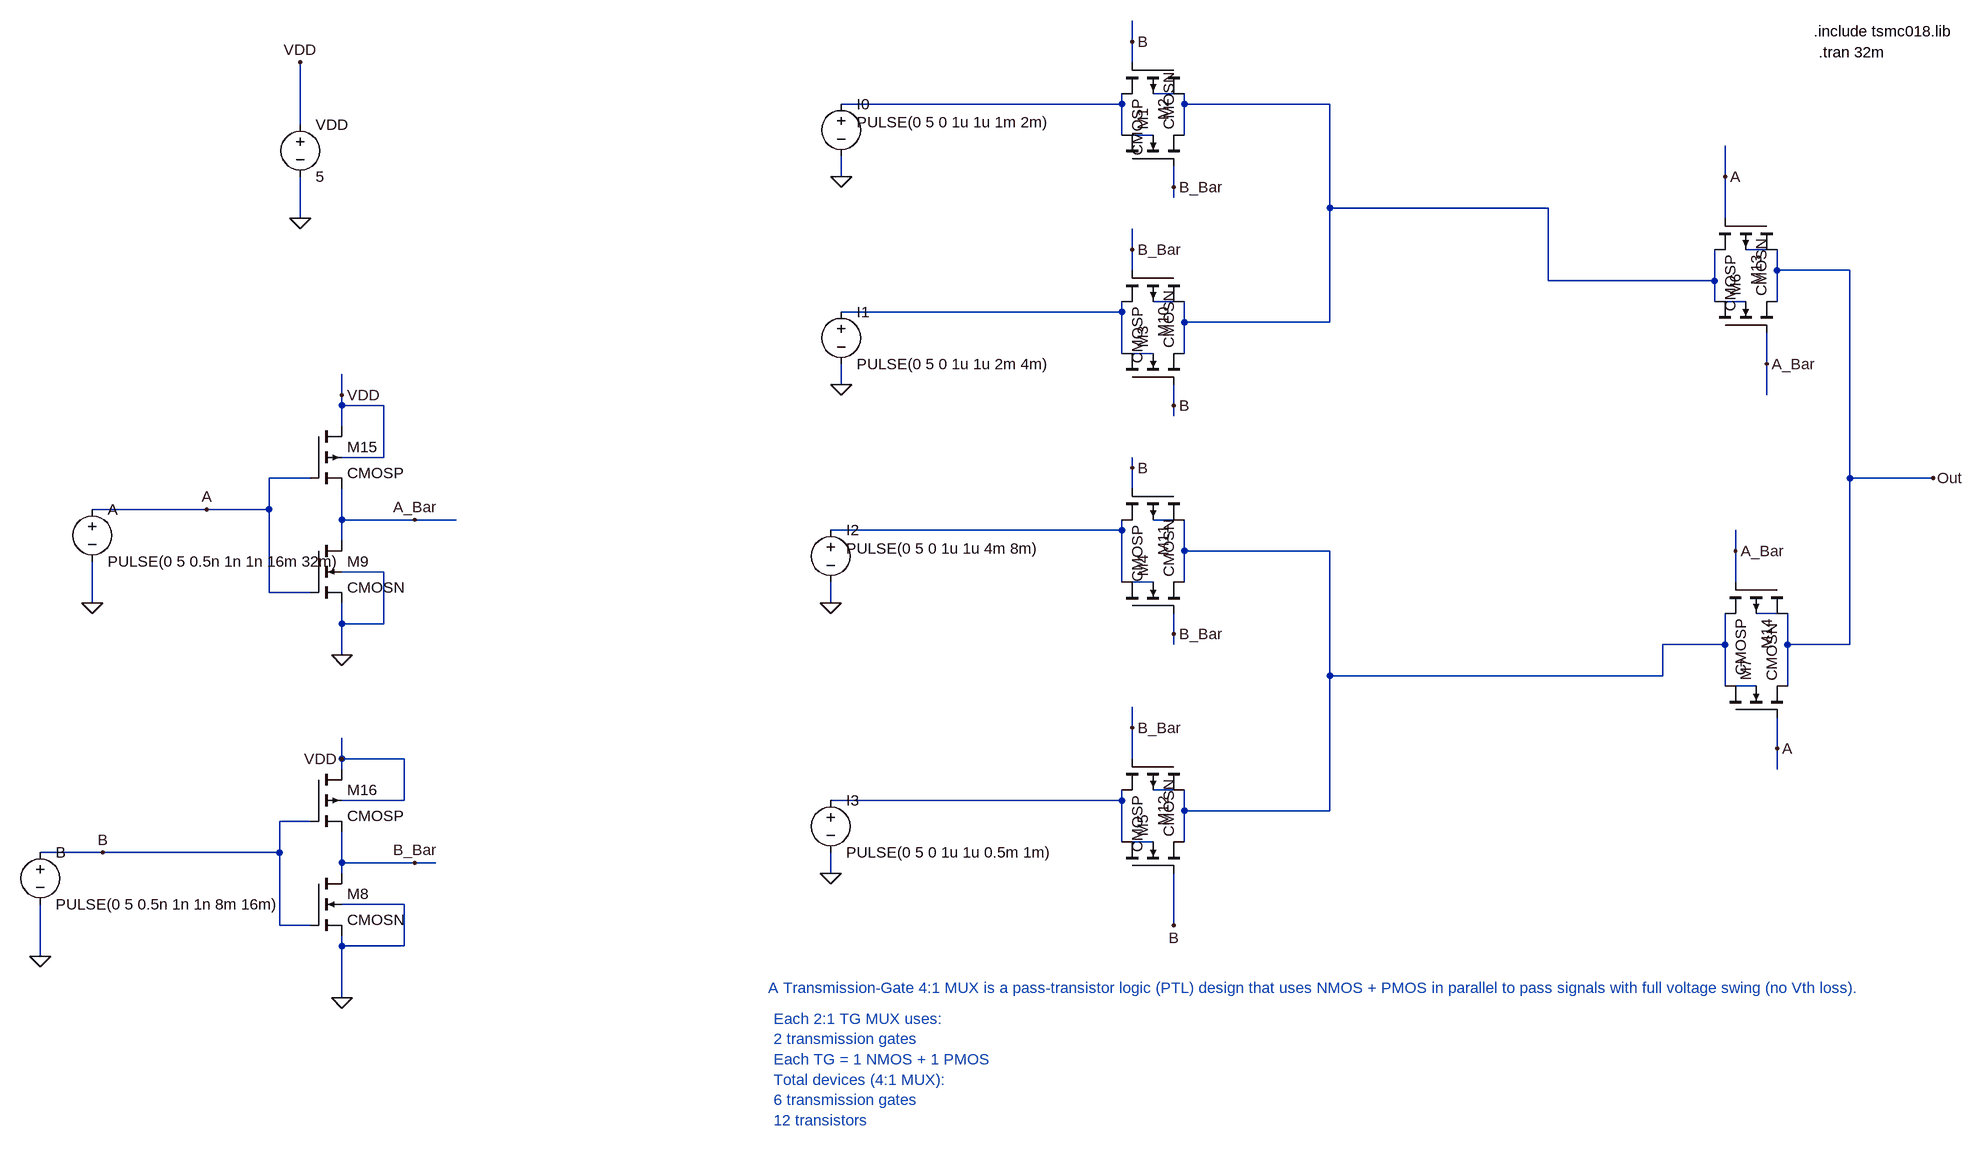
[diagram p0: schematic 4_1_Mux.asc]
4_1_Mux.asc, the LTspice schematic file:
Version 4
SHEET 1 1484 1848
WIRE 192 -160 192 -192
WIRE 192 -128 192 -160
WIRE 256 -80 224 -80
WIRE 176 -64 176 -80
WIRE 176 -64 -256 -64
WIRE 272 -64 272 -80
WIRE 496 -64 272 -64
WIRE -1088 -32 -1088 -128
WIRE 176 -16 176 -64
WIRE 224 -16 192 -16
WIRE 272 -16 272 -64
WIRE -256 48 -256 16
WIRE 1104 48 1104 0
WIRE 256 64 256 32
WIRE 256 80 256 64
WIRE 496 96 496 -64
WIRE 832 96 496 96
WIRE -1088 112 -1088 48
WIRE 1104 112 1104 48
WIRE 192 160 192 128
WIRE 1168 160 1136 160
WIRE 192 192 192 160
WIRE 1184 192 1184 160
WIRE 1296 192 1184 192
WIRE 832 208 832 96
WIRE 1088 208 1088 160
WIRE 1088 208 832 208
WIRE 256 240 224 240
WIRE 1088 240 1088 208
WIRE 1136 240 1104 240
WIRE 1184 240 1184 192
WIRE 176 256 176 240
WIRE 176 256 -256 256
WIRE 272 272 272 240
WIRE 496 272 496 96
WIRE 496 272 272 272
WIRE 176 320 176 256
WIRE 224 320 192 320
WIRE 272 320 272 272
WIRE 1168 336 1168 288
WIRE -256 368 -256 336
WIRE -1024 384 -1024 352
WIRE 1168 384 1168 336
WIRE -1024 400 -1024 384
WIRE -960 400 -1024 400
WIRE 256 400 256 368
WIRE 256 416 256 400
WIRE -1024 432 -1024 400
WIRE -960 480 -960 400
WIRE -960 480 -1024 480
WIRE 192 496 192 480
WIRE -1072 512 -1136 512
WIRE 1296 512 1296 192
WIRE 1424 512 1296 512
WIRE 192 528 192 496
WIRE -1232 560 -1408 560
WIRE -1136 560 -1136 512
WIRE -1136 560 -1232 560
WIRE -1024 576 -1024 528
WIRE -912 576 -1024 576
WIRE -848 576 -912 576
WIRE 256 576 224 576
WIRE 176 592 176 576
WIRE 176 592 -272 592
WIRE -1024 608 -1024 576
WIRE 272 624 272 576
WIRE 496 624 272 624
WIRE 1120 624 1120 592
WIRE -960 656 -1024 656
WIRE 176 672 176 592
WIRE 224 672 192 672
WIRE 272 672 272 624
WIRE 1120 672 1120 624
WIRE -1136 688 -1136 560
WIRE -1072 688 -1136 688
WIRE -1408 704 -1408 640
WIRE -272 704 -272 672
WIRE 1184 720 1152 720
WIRE -1024 736 -1024 704
WIRE -960 736 -960 656
WIRE -960 736 -1024 736
WIRE 256 752 256 720
WIRE 256 768 256 752
WIRE 1104 768 1104 720
WIRE 1104 768 1008 768
WIRE 1200 768 1200 720
WIRE 1296 768 1296 512
WIRE 1296 768 1200 768
WIRE -1024 784 -1024 736
WIRE 496 816 496 624
WIRE 1008 816 1008 768
WIRE 1008 816 496 816
WIRE 1104 832 1104 768
WIRE 1152 832 1120 832
WIRE 1200 832 1200 768
WIRE 192 896 192 864
WIRE 1184 928 1184 880
WIRE -1024 944 -1024 912
WIRE -928 944 -1024 944
WIRE 192 944 192 896
WIRE -1024 960 -1024 944
WIRE 1184 960 1184 928
WIRE 256 992 224 992
WIRE -928 1008 -928 944
WIRE -928 1008 -1024 1008
WIRE 176 1008 176 992
WIRE 176 1008 -272 1008
WIRE 272 1024 272 992
WIRE 496 1024 496 816
WIRE 496 1024 272 1024
WIRE -1072 1040 -1120 1040
WIRE 176 1072 176 1008
WIRE 224 1072 192 1072
WIRE 272 1072 272 1024
WIRE -1392 1088 -1488 1088
WIRE -1120 1088 -1120 1040
WIRE -1120 1088 -1392 1088
WIRE -1024 1104 -1024 1056
WIRE -912 1104 -1024 1104
WIRE -880 1104 -912 1104
WIRE -1024 1120 -1024 1104
WIRE -272 1120 -272 1088
WIRE -928 1168 -1024 1168
WIRE -1120 1200 -1120 1088
WIRE -1072 1200 -1120 1200
WIRE 256 1200 256 1120
WIRE -1024 1232 -1024 1216
WIRE -928 1232 -928 1168
WIRE -928 1232 -1024 1232
WIRE -1488 1248 -1488 1168
WIRE -1024 1312 -1024 1232
FLAG -1488 1248 0
FLAG -1408 704 0
FLAG -272 1120 0
FLAG -272 704 0
FLAG -256 368 0
FLAG -256 48 0
FLAG -1088 112 0
FLAG -1088 -128 VDD
FLAG -1024 944 VDD
FLAG -1024 384 VDD
FLAG -1024 1312 0
FLAG -1024 784 0
FLAG 192 -160 B
FLAG 256 400 B
FLAG 192 496 B
FLAG 256 1200 B
FLAG -912 1104 B_Bar
FLAG 256 64 B_Bar
FLAG 192 160 B_Bar
FLAG 256 752 B_Bar
FLAG 192 896 B_Bar
FLAG -1392 1088 B
FLAG -1232 560 A
FLAG 1184 928 A
FLAG 1104 48 A
FLAG -912 576 A_Bar
FLAG 1120 624 A_Bar
FLAG 1168 336 A_Bar
FLAG 1424 512 Out
SYMBOL cmosn 176 32 R270
SYMATTR InstName M1
SYMBOL cmosp 272 -128 R90
SYMATTR InstName M2
SYMBOL cmosn 176 368 R270
SYMATTR InstName M3
SYMBOL cmosn 176 720 R270
SYMATTR InstName M4
SYMBOL cmosn 176 1120 R270
SYMATTR InstName M5
SYMBOL cmosn 1088 288 R270
SYMATTR InstName M6
SYMBOL cmosn 1104 880 R270
SYMATTR InstName M7
SYMBOL cmosn -1072 1120 R0
SYMATTR InstName M8
SYMBOL cmosn -1072 608 R0
SYMATTR InstName M9
SYMBOL cmosp 272 192 R90
SYMATTR InstName M10
SYMBOL cmosp 272 528 R90
SYMATTR InstName M11
SYMBOL cmosp 272 944 R90
SYMATTR InstName M12
SYMBOL cmosp 1184 112 R90
SYMATTR InstName M13
SYMBOL cmosp 1200 672 R90
SYMATTR InstName M14
SYMBOL cmosp -1072 432 R0
SYMATTR InstName M15
SYMBOL cmosp -1072 960 R0
SYMATTR InstName M16
SYMBOL voltage -1488 1072 R0
WINDOW 123 0 0 Left 0
WINDOW 39 0 0 Left 0
SYMATTR InstName B
SYMATTR Value PULSE(0 5 0.5n 1n 1n 8m 16m)
SYMBOL voltage -1408 544 R0
WINDOW 123 0 0 Left 0
WINDOW 39 0 0 Left 0
SYMATTR InstName A
SYMATTR Value PULSE(0 5 0.5n 1n 1n 16m 32m)
SYMBOL voltage -272 992 R0
WINDOW 123 0 0 Left 0
WINDOW 39 0 0 Left 0
SYMATTR InstName I3
SYMATTR Value PULSE(0 5 0 1u 1u 0.5m 1m)
SYMBOL voltage -272 576 R0
WINDOW 3 24 44 Left 2
WINDOW 123 0 0 Left 0
WINDOW 39 0 0 Left 0
SYMATTR Value PULSE(0 5 0 1u 1u 4m 8m)
SYMATTR InstName I2
SYMBOL voltage -256 240 R0
WINDOW 123 0 0 Left 0
WINDOW 39 0 0 Left 0
SYMATTR InstName I1
SYMATTR Value PULSE(0 5 0 1u 1u 2m 4m)
SYMBOL voltage -256 -80 R0
WINDOW 3 24 44 Left 2
WINDOW 123 0 0 Left 0
WINDOW 39 0 0 Left 0
SYMATTR Value PULSE(0 5 0 1u 1u 1m 2m)
SYMATTR InstName I0
SYMBOL voltage -1088 -48 R0
WINDOW 123 0 0 Left 0
WINDOW 39 0 0 Left 0
SYMATTR InstName VDD
SYMATTR Value 5
TEXT 1248 -144 Left 2 !.tran 32m
TEXT 1240 -176 Left 2 !.include tsmc018.lib
TEXT -368 1296 Left 2 ;A Transmission-Gate 4:1 MUX is a pass-transistor logic (PTL) design that uses NMOS + PMOS in parallel to pass signals with full voltage swing (no Vth loss).
TEXT -360 1344 Left 2 ;Each 2:1 TG MUX uses:\n2 transmission gates\nEach TG = 1 NMOS + 1 PMOS\nTotal devices (4:1 MUX):\n6 transmission gates\n12 transistors

The netlist it stands for:
* 4_1_Mux.asc
M1 N002 B_Bar N003 N004 CMOSN
M2 N003 B N002 N001 CMOSP
M3 N008 B N003 N009 CMOSN
M4 N011 B_Bar N012 N013 CMOSN
M5 N017 B N012 N018 CMOSN
M6 N003 A_Bar Out N007 CMOSN
M7 N012 A Out N015 CMOSN
M8 B_Bar B 0 0 CMOSN
M9 A_Bar A 0 0 CMOSN
M10 N003 B_Bar N008 N006 CMOSP
M11 N012 B N011 N010 CMOSP
M12 N012 B_Bar N017 N016 CMOSP
M13 Out A N003 N005 CMOSP
M14 Out A_Bar N012 N014 CMOSP
M15 VDD A A_Bar VDD CMOSP
M16 VDD B B_Bar VDD CMOSP
V§B B 0 PULSE(0 5 0.5n 1n 1n 8m 16m)
V§A A 0 PULSE(0 5 0.5n 1n 1n 16m 32m)
V§I3 N017 0 PULSE(0 5 0 1u 1u 0.5m 1m)
V§I2 N011 0 PULSE(0 5 0 1u 1u 4m 8m)
V§I1 N008 0 PULSE(0 5 0 1u 1u 2m 4m)
V§I0 N002 0 PULSE(0 5 0 1u 1u 1m 2m)
VDD VDD 0 5
.model NMOS NMOS
.model PMOS PMOS
.lib standard.mos
.tran 32m
.include tsmc018.lib
* A Transmission-Gate 4:1 MUX is a pass-transistor logic (PTL) design that uses NMOS + PMOS in parallel to pass signals with full voltage swing (no Vth loss).
* Each 2:1 TG MUX uses:
* 2 transmission gates
* Each TG = 1 NMOS + 1 PMOS
* Total devices (4:1 MUX):
* 6 transmission gates
* 12 transistors
.backanno
.end